# Altium schematic sheet uc.SchDoc
size A4
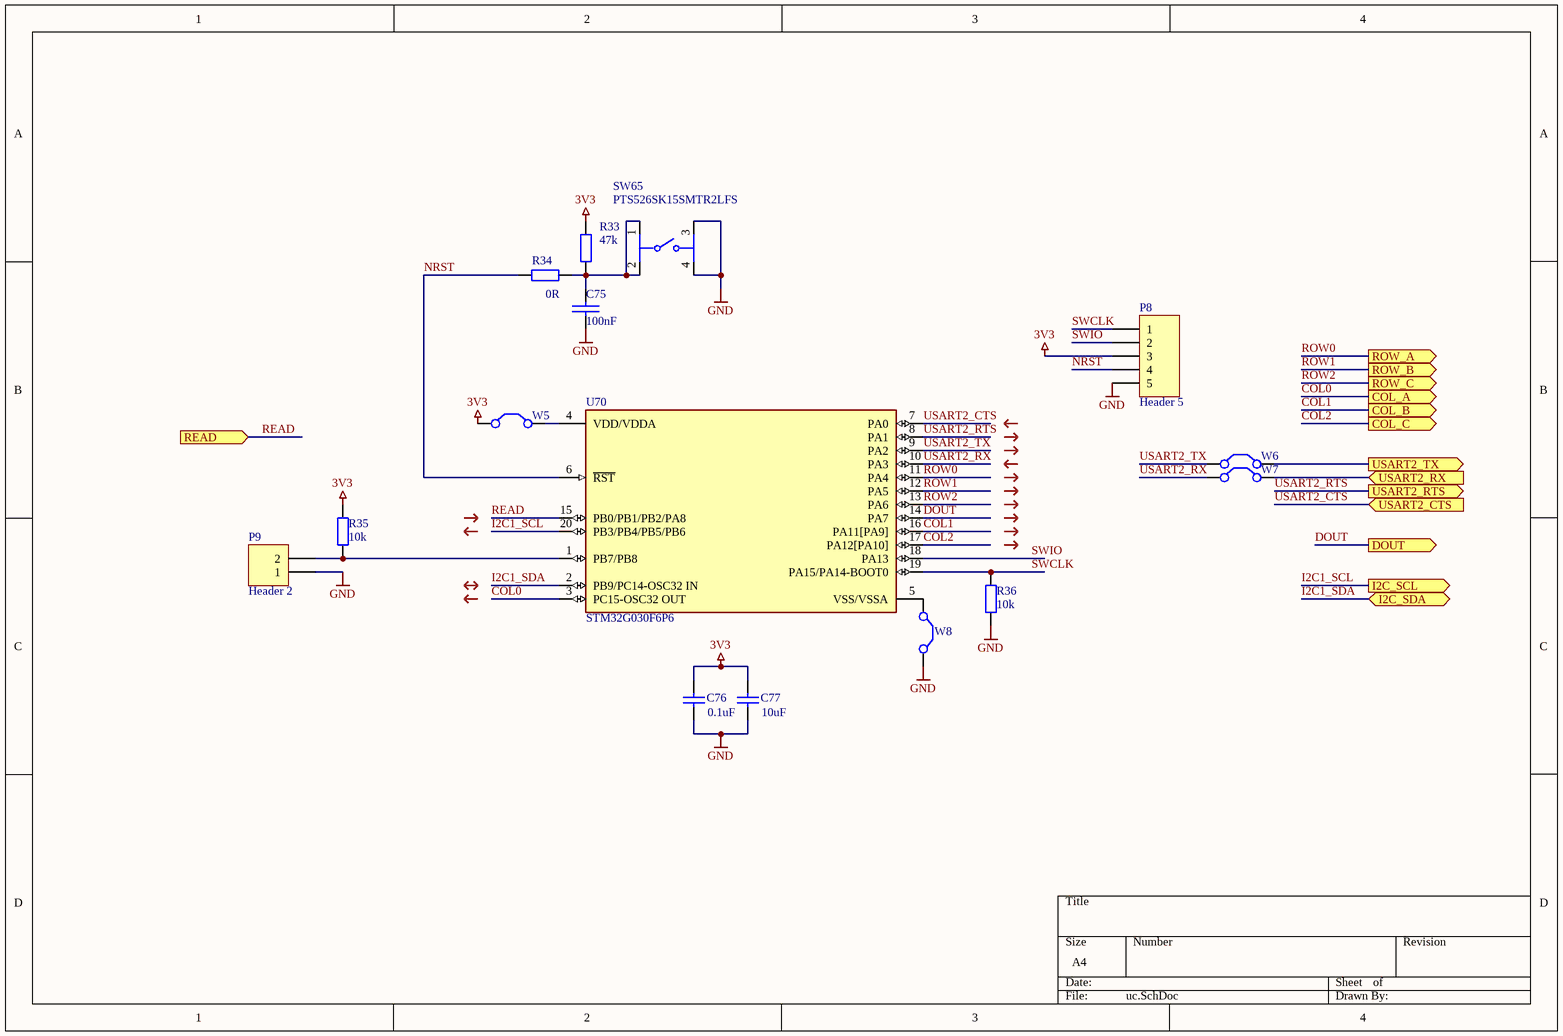
[diagram p0: uc.SchDoc]

## Parts
C75  100nF  [Cap_0805]
C76  0.1uF  [Cap_0805]
C77  10uF  [Cap_0805]
P8  Header 5  [HDR1X5]
P9  Header 2  [HDR1X2]
R33  47k  [RES_0805]
R34  0R  [RES_0805]
R35  10k  [RES_0805]
R36  10k  [RES_0805]
SW65  PTS526SK15SMTR2LFS  [FP-PTS526SK15SMTR2LFS-MFG]
U70  STM32G030F6P6  [FP-TSSOP20-YA-MFG]
W5  Jumper  [JUMPER]  (value not drawn)
W6  Jumper  [JUMPER]  (value not drawn)
W7  Jumper  [JUMPER]  (value not drawn)
W8  Jumper  [JUMPER]  (value not drawn)

## Ports
COL_A (out), COL_B (out), COL_C (out), DOUT (out), I2C_SCL (out), I2C_SDA (bidir), READ (in), ROW_A (out), ROW_B (out), ROW_C (out), USART2_CTS (in), USART2_RTS (out), USART2_RX (in), USART2_TX (out)

## Nets
3V3: C76.2 C77.2 P8.3 R33.1 R35.2 W5.1(C1)
GND: C75.2 C76.1 C77.1 P8.5 P9.1 R36.1 SW65.3 SW65.4 W8.2(C2)
COL0: U70.3(PC15-OSC32_OUT) ; port COL_A
COL1: U70.16(PA11[PA9]) ; port COL_B
COL2: U70.17(PA12[PA10]) ; port COL_C
DOUT: U70.14(PA7) ; port DOUT
I2C1_SCL: U70.20(PB3/PB4/PB5/PB6) ; port I2C_SCL
I2C1_SDA: U70.2(PB9/PC14-OSC32_IN) ; port I2C_SDA
NRST: P8.4 R34.1 U70.6(~{RST})
READ: U70.15(PB0/PB1/PB2/PA8) ; port READ
ROW0: U70.11(PA4) ; port ROW_A
ROW1: U70.12(PA5) ; port ROW_B
ROW2: U70.13(PA6) ; port ROW_C
SWCLK: P8.1 R36.2 U70.19(PA15/PA14-BOOT0)
SWIO: P8.2 U70.18(PA13)
USART2_CTS: U70.7(PA0) ; port USART2_CTS
USART2_RTS: U70.8(PA1) ; port USART2_RTS
USART2_RX: U70.10(PA3) W7.1(C1)
USART2_RX: W7.2(C2) ; port USART2_RX  [a separate net that carries the same name]
USART2_TX: U70.9(PA2) W6.1(C1)
USART2_TX: W6.2(C2) ; port USART2_TX  [a separate net that carries the same name]
NetC75_1: C75.1 R33.2 R34.2 SW65.1 SW65.2
NetP9_2: P9.2 R35.1 U70.1(PB7/PB8)
NetU70_4: U70.4(VDD/VDDA) W5.2(C2)
NetU70_5: U70.5(VSS/VSSA) W8.1(C1)

## Library data of the parts
C75 = C: SDTSourceLibName: C:\WINDOWS\TEMP\DA.LIB; PCB Footprint: RC0805
C76 C77 = Cap: Capacitor; Published: 8-Jun-2000; LatestRevisionDate: 17-Jul-2002; LatestRevisionNote: Re-released for DXP Platform.; PackageReference: RAD-0.3; Publisher: Altium Limited; PackageDescription: Radial Cap, Thru-Hole; 2 Leads; 0.3 in Pin Spacing
  C76: Value: 0.1uF
  C77: Value: 10uF
P8 = Header 5: Header, 5-Pin; LatestRevisionDate: 17-Jul-2002; LatestRevisionNote: Re-released for DXP Platform.; Publisher: Altium Limited
P9 = Header 2: Header, 2-Pin; LatestRevisionDate: 17-Jul-2002; LatestRevisionNote: Re-released for DXP Platform.; Publisher: Altium Limited
R33 R34 = Res2: Res 0805; Value: 1K; Published: 8-Jun-2000; LatestRevisionDate: 17-Jul-2002; LatestRevisionNote: Re-released for DXP Platform.; PackageReference: AXIAL-0.4; Publisher: Altium Limited; PackageDescription: Axial Device, Thru-Hole; 2 Leads; 0.4 in Pin Spacing
R35 R36 = Res2: Resistor; Published: 8-Jun-2000; LatestRevisionDate: 17-Jul-2002; LatestRevisionNote: Re-released for DXP Platform.; PackageReference: AXIAL-0.4; Publisher: Altium Limited; PackageDescription: Axial Device, Thru-Hole; 2 Leads; 0.4 in Pin Spacing; Value: 10k
SW65 = CMP-10040-000013-1: TACT 5.2 X 5.2, 1.5 MM H, 260GF,; Manufacturer: C&K; Operating Force: 250gf; Throw Configuration: SPST-NO; Contact Current Rating: 50mA; Standoff Height: 0mm; Contact Resistance: 100mΩ; Voltage Rating Dc: 12V; Electromechanical Life: 200000Cycles; Device Class L3: Tactile Switches; Device Class L2: Switches; Temperature: -20°C to +70°C; Temperature Range Low: -20°C; Package: PTS526SK15SMTR2LFS; Temperature Range High: +70°C; ComponentLink2Description: Datasheet; Device Class L1: Electromechanical; Height: 1.65mm; Digikey Description: TACT 5.2 X 5.2, 1.5 MM H, 260GF,; Category: Switch; RoHS: TRUE; Automotive: No; Lead Free: Yes; Manufacturer Part Number: PTS526SK15SMTR2LFS; Octopart: https://octopart.com/pts526+sk15+smtr2+lfs-c%26k+components-100617999; ComponentLink2URL: https://www.ckswitches.com/media/2780/pts526.pdf
U70 = CMP-12105-000034-1: ARM MICROCONTROLLERS - MCU; Manufacturer: STMicroelectronics; Max Supply Voltage: 3.6V; Interface: I2C,SPI,USART,LIN,IrDA,I2S,SMBus; Memory Size: 32KBytes; Number Of I/Os: 17; Number Of Timers/Counters: 6; Core Architecture: ARM Cortex-M0+; Number Of Pwm Channels: 11; Standoff Height: 0.05mm; Number Of A/D Converters: 1; Number Of I2C Channels: 2; Data Bus Width: 32bits; Ram Size: 8KBytes; Max Junction Temp: +105°C; Number Of Spi Channels: 3; Min Supply Voltage: 2V; Number Of Adc Channels: 16; Memory Type: FLASH; Frequency: 64MHz; Ambient Temperature Range Low: -40°C; ComponentLink2URL: https://www.st.com/resource/en/datasheet/stm32g030f6.pdf; Temperature Range Low: -40°C; Automotive: No; Device Class L1: Integrated Circuits (ICs); Category: IC; Temperature Range High: +85°C; ComponentLink2Description: Datasheet; Device Class L2: Embedded Processors and Controllers; Manufacturer Part Number: STM32G030F6P6; Height: 1.2mm; Ambient Temperature Range High: +85°C; Octopart: https://octopart.com/stm32g030f6p6-stmicroelectronics-103773023; Package: TSSOP20-YA; Temperature: -40°C to +85°C; Lead Free: Yes; Device Class L3: Microcontrollers; Number Of Uart Channels: 2; RoHS: TRUE; Number Of Cores: 1; Digikey Description: ARM MICROCONTROLLERS - MCU
W5-W8 = Jumper: Jumper Wire; Published: 24-Mar-1999; LatestRevisionDate: 17-Jul-2002; LatestRevisionNote: Re-released for DXP Platform.; PackageReference: RAD-0.2; Publisher: Altium Limited; PackageDescription: Radial Cap, Thru-Hole; 2 Leads; 0.2 in Pin Spacing